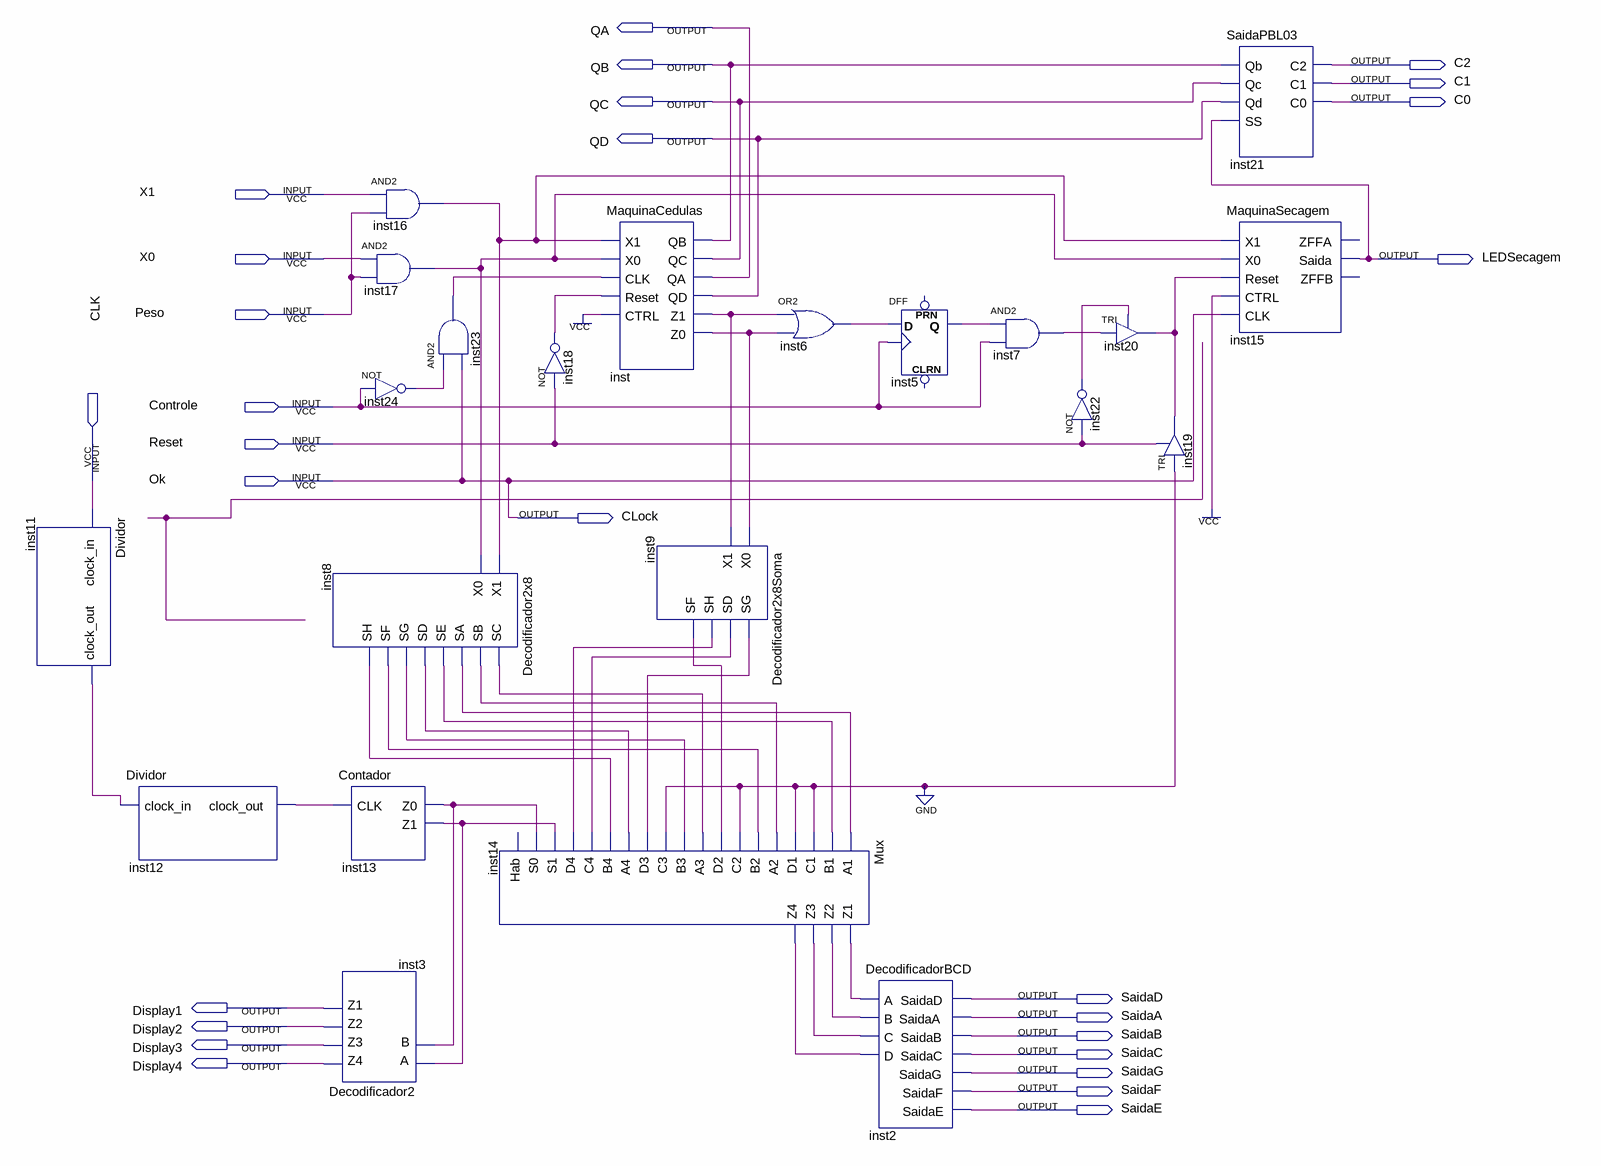
[diagram p0: schematic sheet]
// Quartus schematic pbl03.bdf as structural Verilog: 22 symbols, 27 pins
module pbl03 (
  input  X1,
  input  X0,
  input  Peso,
  input  Controle,
  input  Reset,
  input  CLK,
  input  Ok,
  output QA,
  output QB,
  output C2,
  output C1,
  output QC,
  output C0,
  output QD,
  output LEDSecagem,
  output CLock,
  output SaidaD,
  output Display1,
  output SaidaA,
  output Display2,
  output SaidaB,
  output Display3,
  output SaidaC,
  output Display4,
  output SaidaG,
  output SaidaF,
  output SaidaE
);

  wire inst5_q, inst6_out, inst7_out, inst8_sa, inst8_sb, inst8_sc, inst8_sd, inst8_se, inst8_sf, inst8_sg,
       inst8_sh, inst9_sd, inst9_sf, inst9_sg, inst9_sh, inst11_clock_out, inst12_clock_out, inst13_z0,
       inst13_z1, inst14_z1, inst14_z2, inst14_z3, inst14_z4, inst16_out, inst17_out, inst18_out, inst20_out,
       inst22_out, inst23_out, inst24_out, inst_z0, inst_z1;

  Dividor inst11 (.clock_in(CLK), .clock_out(inst11_clock_out));
  Dividor inst12 (.clock_in(inst11_clock_out), .clock_out(inst12_clock_out));
  Decodificador2x8 inst8 (
    .X1(inst16_out), .X0(inst17_out), .SC(inst8_sc), .SB(inst8_sb), .SA(inst8_sa), .SE(inst8_se),
    .SD(inst8_sd), .SG(inst8_sg), .SF(inst8_sf), .SH(inst8_sh));
  Decodificador2 inst3 (.A(inst13_z1), .B(inst13_z0), .Z4(Display4), .Z3(Display3), .Z2(Display2), .Z1(Display1));
  and inst16 (inst16_out, X1, Peso);
  and inst17 (inst17_out, X0, Peso);
  not inst24 (inst24_out, Controle);
  Contador inst13 (.CLK(inst12_clock_out), .Z0(inst13_z0), .Z1(inst13_z1));
  and inst23 (inst23_out, inst24_out, Ok);
  not inst18 (inst18_out, Reset);
  Mux inst14 (
    .A1(inst8_sa), .B1(inst8_se), .C1(1'b0), .D1(1'b0), .A2(inst8_sb), .B2(inst8_sf), .C2(1'b0),
    .D2(inst9_sf), .A3(inst8_sc), .B3(inst8_sg), .C3(1'b0), .D3(inst9_sg), .A4(inst8_sd), .B4(inst8_sh),
    .C4(inst9_sd), .D4(inst9_sh), .S1(inst13_z1), .S0(inst13_z0), .Z1(inst14_z1), .Z2(inst14_z2),
    .Z3(inst14_z3), .Z4(inst14_z4));  // open: Hab
  MaquinaCedulas inst (
    .X1(inst16_out), .X0(inst17_out), .CLK(inst23_out), .Reset(inst18_out), .CTRL(1'b1), .QB(QB), .QC(QC),
    .QA(QA), .QD(QD), .Z1(inst_z1), .Z0(inst_z0));
  Decodificador2x8Soma inst9 (.X0(inst_z0), .X1(inst_z1), .SG(inst9_sg), .SD(inst9_sd), .SH(inst9_sh), .SF(inst9_sf));
  or inst6 (inst6_out, inst_z1, inst_z0);
  DFF inst5 (.CLK(Controle), .D(inst6_out), .Q(inst5_q));  // open: CLRN, PRN
  DecodificadorBCD inst2 (
    .A(inst14_z1), .B(inst14_z2), .C(inst14_z3), .D(inst14_z4), .SaidaD(SaidaD), .SaidaA(SaidaA),
    .SaidaB(SaidaB), .SaidaC(SaidaC), .SaidaG(SaidaG), .SaidaF(SaidaF), .SaidaE(SaidaE));
  and inst7 (inst7_out, inst5_q, Controle);
  not inst22 (inst22_out, Reset);
  TRI inst20 (.IN(inst7_out), .OE(inst22_out), .OUT(inst20_out));
  TRI inst19 (.IN(1'b0), .OE(Reset), .OUT(inst20_out));
  SaidaPBL03 inst21 (.Qb(QB), .Qc(QC), .Qd(QD), .SS(LEDSecagem), .C2(C2), .C1(C1), .C0(C0));
  MaquinaSecagem inst15 (
    .X1(inst16_out), .X0(inst17_out), .Reset(inst20_out), .CTRL(1'b1), .CLK(Ok), .Saida(LEDSecagem));  // open: ZFFA, ZFFB

  assign CLock = Ok;
endmodule
